# Altium schematic sheet LAN9254_C_P2.SchDoc
size 431 x 279 mm; DocumentNumber: 15; SheetNumber: 9; SheetTotal: 13
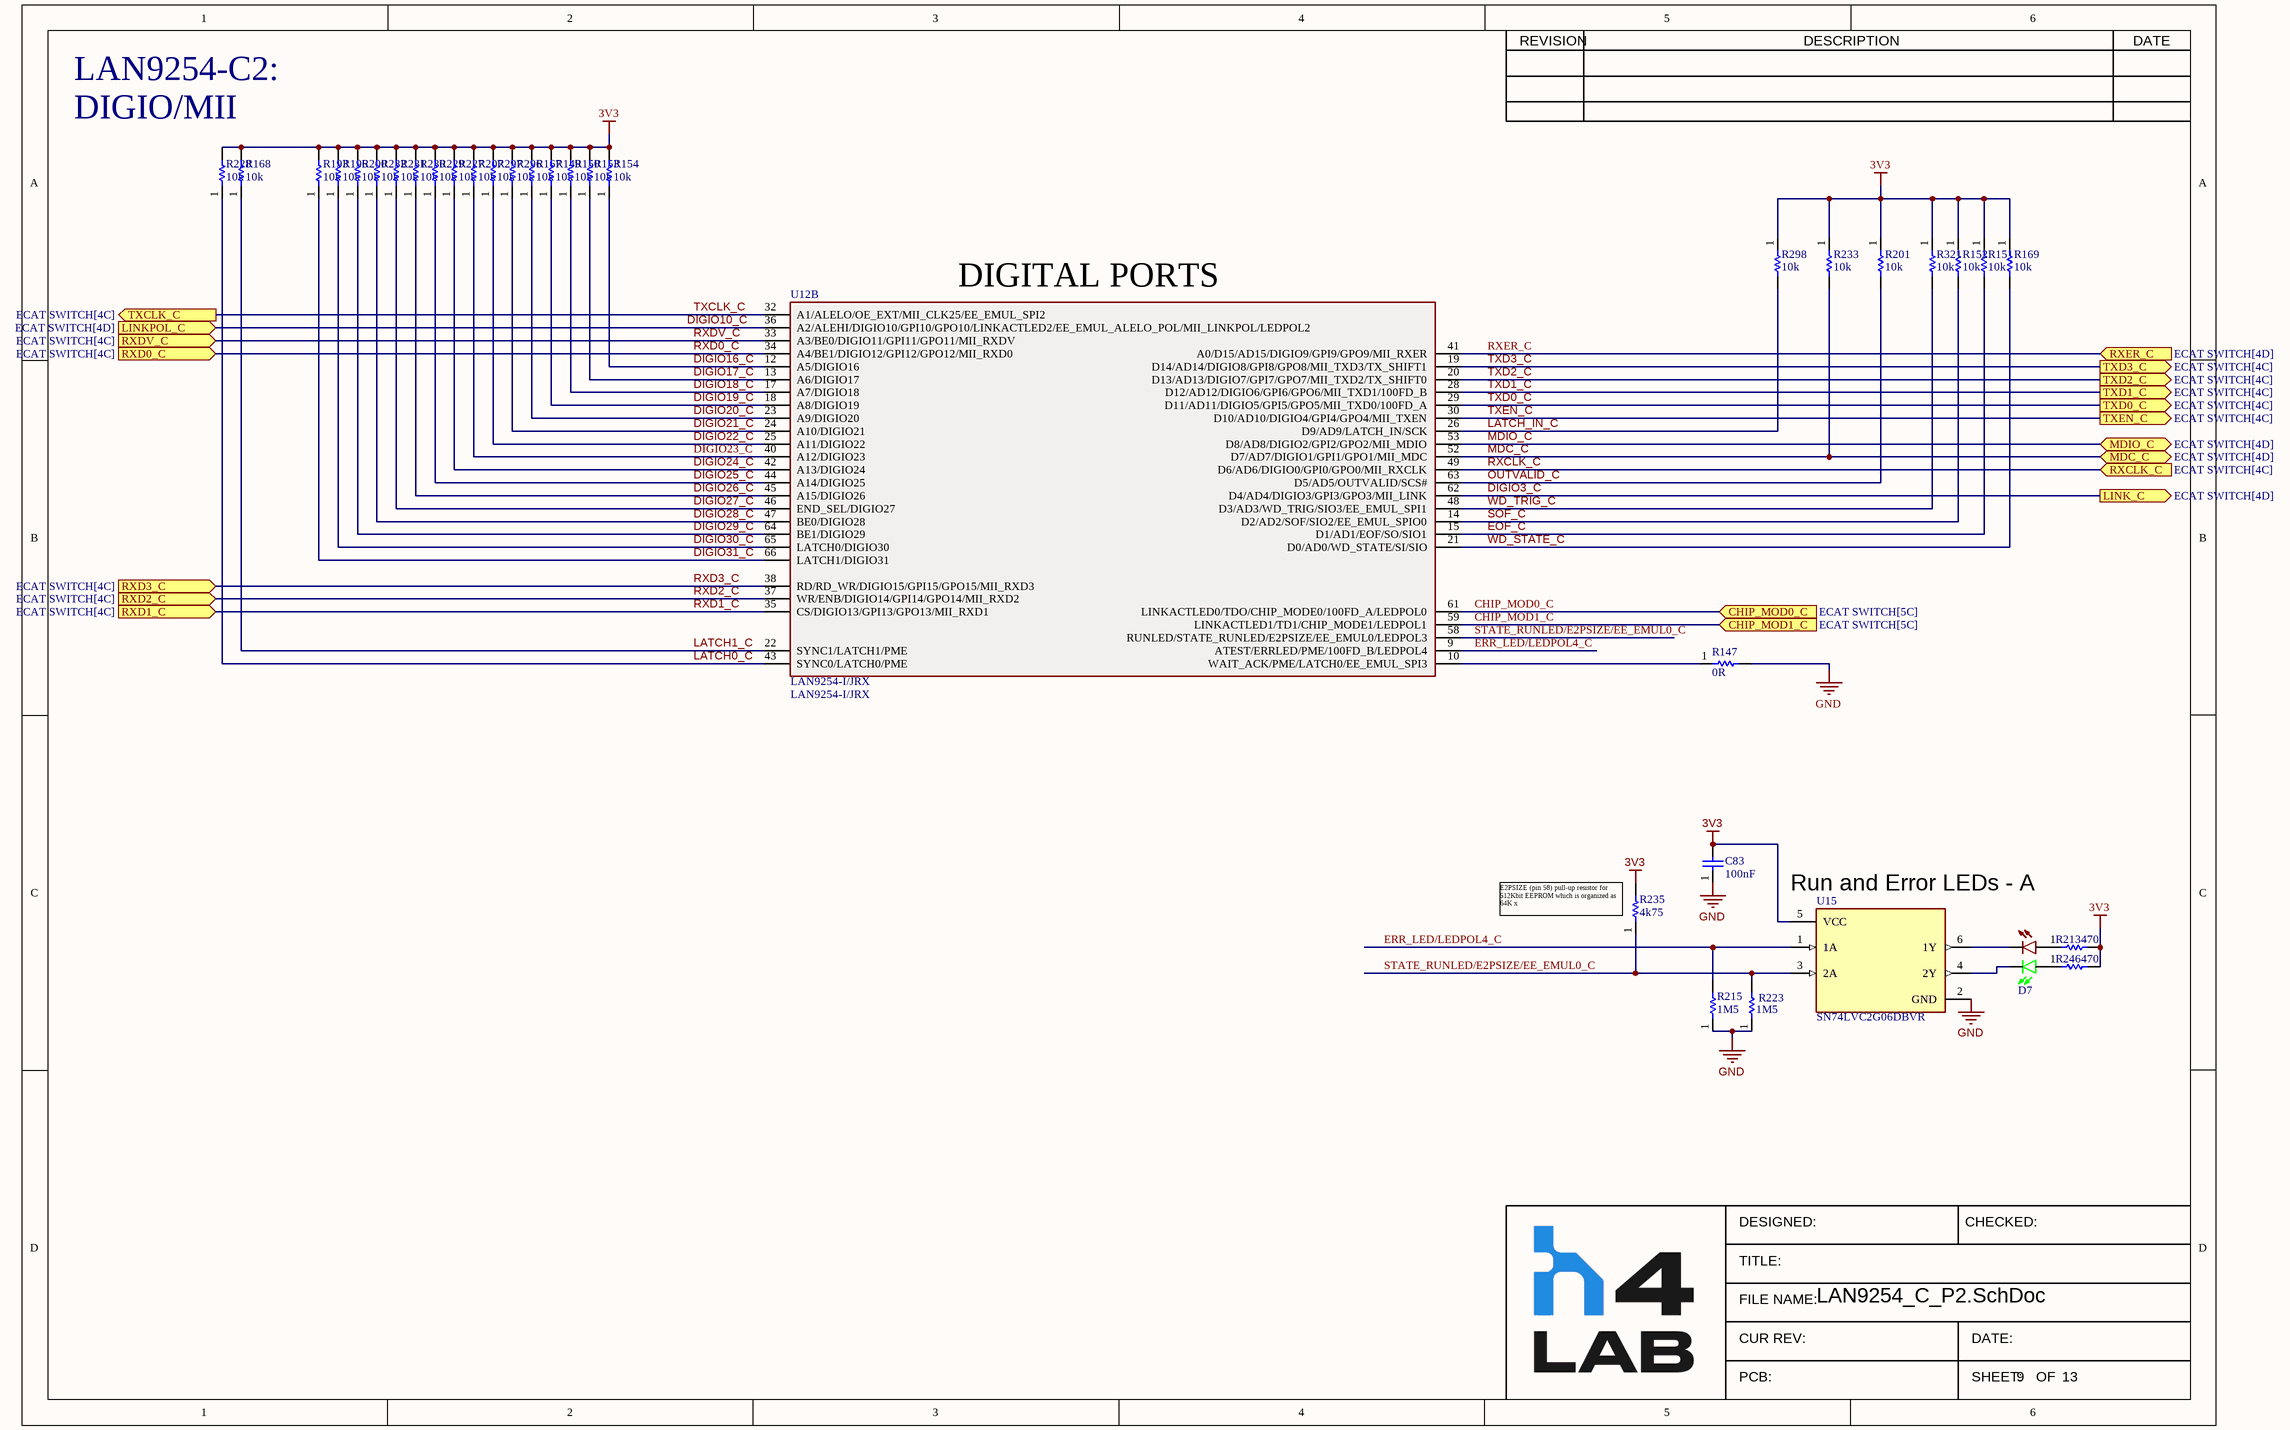
[diagram p0: LAN9254_C_P2.SchDoc]

## Parts
C83  value 100nF  [CAPC1005X03N(0402)]  (hidden comment: GRM155R71C104JA88D)
D7  LTST-C195KGJRKT  [Dual_LED]  (value not drawn)
R147  value 0R  [0402]  (hidden comment: RCS04020000Z0ED)
R149  value 10k  [RESC1005X06N(0402)]  (hidden comment: RC0402FR-0710KL)
R150  value 10k  [RESC1005X06N(0402)]  (hidden comment: RC0402FR-0710KL)
R151  value 10k  [RESC1005X06N(0402)]  (hidden comment: RC0402FR-0710KL)
R152  value 10k  [RESC1005X06N(0402)]  (hidden comment: RC0402FR-0710KL)
R153  value 10k  [RESC1005X06N(0402)]  (hidden comment: RC0402FR-0710KL)
R154  value 10k  [RESC1005X06N(0402)]  (hidden comment: RC0402FR-0710KL)
R167  value 10k  [RESC1005X06N(0402)]  (hidden comment: RC0402FR-0710KL)
R168  value 10k  [RESC1005X06N(0402)]  (hidden comment: RC0402FR-0710KL)
R169  value 10k  [RESC1005X06N(0402)]  (hidden comment: RC0402FR-0710KL)
R193  value 10k  [RESC1005X06N(0402)]  (hidden comment: RC0402FR-0710KL)
R196  value 10k  [RESC1005X06N(0402)]  (hidden comment: RC0402FR-0710KL)
R200  value 10k  [RESC1005X06N(0402)]  (hidden comment: RC0402FR-0710KL)
R201  value 10k  [RESC1005X06N(0402)]  (hidden comment: RC0402FR-0710KL)
R207  value 10k  [RESC1005X06N(0402)]  (hidden comment: RC0402FR-0710KL)
R213  value 470  [0402]  (hidden comment: CRCW0402470RJNED)
R215  value 1M5  [0402]  (hidden comment: CRCW04021M50JNED)
R223  value 1M5  [0402]  (hidden comment: CRCW04021M50JNED)
R227  value 10k  [RESC1005X06N(0402)]  (hidden comment: RC0402FR-0710KL)
R228  value 10k  [RESC1005X06N(0402)]  (hidden comment: RC0402FR-0710KL)
R229  value 10k  [RESC1005X06N(0402)]  (hidden comment: RC0402FR-0710KL)
R230  value 10k  [RESC1005X06N(0402)]  (hidden comment: RC0402FR-0710KL)
R231  value 10k  [RESC1005X06N(0402)]  (hidden comment: RC0402FR-0710KL)
R232  value 10k  [RESC1005X06N(0402)]  (hidden comment: RC0402FR-0710KL)
R233  value 10k  [RESC1005X06N(0402)]  (hidden comment: RC0402FR-0710KL)
R235  value 4k75  [RESC1005X06N(0402)]  (hidden comment: RC0402FR-074K75L)
R246  value 470  [0402]  (hidden comment: CRCW0402470RJNED)
R296  value 10k  [RESC1005X06N(0402)]  (hidden comment: RC0402FR-0710KL)
R297  value 10k  [RESC1005X06N(0402)]  (hidden comment: RC0402FR-0710KL)
R298  value 10k  [RESC1005X06N(0402)]  (hidden comment: RC0402FR-0710KL)
R321  value 10k  [RESC1005X06N(0402)]  (hidden comment: RC0402FR-0710KL)
U12  LAN9254-I/JRX  [QFP50P1400X1400X120-81N]  (part B of 2)
U15  SN74LVC2G06DBVR  [FP-DBV0006A-IPC_C]

## Ports
CHIP_MOD0_C (in, see ECAT SWITCH[5C]), CHIP_MOD1_C (in, see ECAT SWITCH[5C]), LINK_C (out, see ECAT SWITCH[4D]), LINKPOL_C (in, see ECAT SWITCH[4D]), MDC_C (bidir, see ECAT SWITCH[4D]), MDIO_C (bidir, see ECAT SWITCH[4D]), RXCLK_C (in, see ECAT SWITCH[4C]), RXD0_C (in, see ECAT SWITCH[4C]), RXD1_C (in, see ECAT SWITCH[4C]), RXD2_C (in, see ECAT SWITCH[4C]), RXD3_C (in, see ECAT SWITCH[4C]), RXDV_C (in, see ECAT SWITCH[4C]), RXER_C (in, see ECAT SWITCH[4D]), TXCLK_C (out, see ECAT SWITCH[4C]), TXD0_C (out, see ECAT SWITCH[4C]), TXD1_C (out, see ECAT SWITCH[4C]), TXD2_C (out, see ECAT SWITCH[4C]), TXD3_C (out, see ECAT SWITCH[4C]), TXEN_C (out, see ECAT SWITCH[4C])

## Nets
3V3: C83.2 R149.2 R150.2 R151.1 R152.1 R153.2 R154.2 R167.2 R168.2 R169.1 R193.2 R196.2 R200.2 R201.1 R207.2 R213.2 R227.2 R228.2 R229.2 R230.2 R231.2 R232.2 R233.1 R235.2 R246.2 R296.2 R297.2 R298.1 R321.1 U15.5(VCC)
GND: C83.1 R147.2 R215.1 R223.1 U15.2(GND)
CHIP_MOD0_C: U12.61(LINKACTLED0/TDO/CHIP_MODE0/100FD_A/LEDPOL0) ; port CHIP_MOD0_C
CHIP_MOD1_C: U12.59(LINKACTLED1/TD1/CHIP_MODE1/LEDPOL1) ; port CHIP_MOD1_C
DIGIO3_C: U12.62(D4/AD4/DIGIO3/GPI3/GPO3/MII_LINK) ; port LINK_C
DIGIO10_C: U12.36(A2/ALEHI/DIGIO10/GPI10/GPO10/LINKACTLED2/EE_EMUL_ALELO_POL/MII_LINKPOL/LEDPOL2) ; port LINKPOL_C
DIGIO16_C: R154.1 U12.12(A5/DIGIO16)
DIGIO17_C: R153.1 U12.13(A6/DIGIO17)
DIGIO18_C: R150.1 U12.17(A7/DIGIO18)
DIGIO19_C: R149.1 U12.18(A8/DIGIO19)
DIGIO20_C: R167.1 U12.23(A9/DIGIO20)
DIGIO21_C: R296.1 U12.24(A10/DIGIO21)
DIGIO22_C: R297.1 U12.25(A11/DIGIO22)
DIGIO23_C: R207.1 U12.40(A12/DIGIO23)
DIGIO24_C: R227.1 U12.42(A13/DIGIO24)
DIGIO25_C: R229.1 U12.44(A14/DIGIO25)
DIGIO26_C: R230.1 U12.45(A15/DIGIO26)
DIGIO27_C: R231.1 U12.46(END_SEL/DIGIO27)
DIGIO28_C: R232.1 U12.47(BE0/DIGIO28)
DIGIO29_C: R200.1 U12.64(BE1/DIGIO29)
DIGIO30_C: R196.1 U12.65(LATCH0/DIGIO30)
DIGIO31_C: R193.1 U12.66(LATCH1/DIGIO31)
EOF_C: R151.2 U12.15(D1/AD1/EOF/SO/SIO1)
ERR_LED/LEDPOL4_C: R215.2 U12.9(ATEST/ERRLED/PME/100FD_B/LEDPOL4) U15.1(1A)
LATCH0_C: R228.1 U12.43(SYNC0/LATCH0/PME)
LATCH1_C: R168.1 U12.22(SYNC1/LATCH1/PME)
LATCH_IN_C: R298.2 U12.26(D9/AD9/LATCH_IN/SCK)
MDC_C: R233.2 U12.52(D7/AD7/DIGIO1/GPI1/GPO1/MII_MDC) ; port MDC_C
MDIO_C: U12.53(D8/AD8/DIGIO2/GPI2/GPO2/MII_MDIO) ; port MDIO_C
OUTVALID_C: R201.2 U12.63(D5/AD5/OUTVALID/SCS#)
RXCLK_C: U12.49(D6/AD6/DIGIO0/GPI0/GPO0/MII_RXCLK) ; port RXCLK_C
RXD0_C: U12.34(A4/BE1/DIGIO12/GPI12/GPO12/MII_RXD0) ; port RXD0_C
RXD1_C: U12.35(CS/DIGIO13/GPI13/GPO13/MII_RXD1) ; port RXD1_C
RXD2_C: U12.37(WR/ENB/DIGIO14/GPI14/GPO14/MII_RXD2) ; port RXD2_C
RXD3_C: U12.38(RD/RD_WR/DIGIO15/GPI15/GPO15/MII_RXD3) ; port RXD3_C
RXDV_C: U12.33(A3/BE0/DIGIO11/GPI11/GPO11/MII_RXDV) ; port RXDV_C
RXER_C: U12.41(A0/D15/AD15/DIGIO9/GPI9/GPO9/MII_RXER) ; port RXER_C
SOF_C: R152.2 U12.14(D2/AD2/SOF/SIO2/EE_EMUL_SPIO0)
STATE_RUNLED/E2PSIZE/EE_EMUL0_C: R223.2 R235.1 U12.58(RUNLED/STATE_RUNLED/E2PSIZE/EE_EMUL0/LEDPOL3) U15.3(2A)
TXCLK_C: U12.32(A1/ALELO/OE_EXT/MII_CLK25/EE_EMUL_SPI2) ; port TXCLK_C
TXD0_C: U12.29(D11/AD11/DIGIO5/GPI5/GPO5/MII_TXD0/100FD_A) ; port TXD0_C
TXD1_C: U12.28(D12/AD12/DIGIO6/GPI6/GPO6/MII_TXD1/100FD_B) ; port TXD1_C
TXD2_C: U12.20(D13/AD13/DIGIO7/GPI7/GPO7/MII_TXD2/TX_SHIFT0) ; port TXD2_C
TXD3_C: U12.19(D14/AD14/DIGIO8/GPI8/GPO8/MII_TXD3/TX_SHIFT1) ; port TXD3_C
TXEN_C: U12.30(D10/AD10/DIGIO4/GPI4/GPO4/MII_TXEN) ; port TXEN_C
WD_STATE_C: R169.2 U12.21(D0/AD0/WD_STATE/SI/SIO)
WD_TRIG_C: R321.2 U12.48(D3/AD3/WD_TRIG/SIO3/EE_EMUL_SPI1)
NetD7_1: D7.1 R246.1
NetD7_2: D7.2 R213.1
NetD7_3: D7.3 U15.4(2Y)
NetD7_4: D7.4 U15.6(1Y)
NetR147_1: R147.1 U12.10(WAIT_ACK/PME/LATCH0/EE_EMUL_SPI3)

## Notes on the sheet
- LAN9254-C2:
- DIGIO/MII
- (near U12) DIGITAL PORTS
- (near R235) E2PSIZE (pin 58) pull-up resistor for 512Kbit EEPROM which is organized as 64K x
- (near U15) Run and Error LEDs - A
- REVISION
- DESCRIPTION
- DATE
- DESIGNED:
- CHECKED:
- TITLE:
- FILE NAME:
- CUR REV:
- PCB:
- SHEET:
- DATE:
- OF

## Library data of the parts
C83 = 100nF_16V_0402_CAP: CAP CER 0.1UF 16V X7R 0402; Tolerance: 5%; MPN: GRM155R71C104JA88D; Voltage Rating: 16V; Temp Coeff: X7R; Size/Package: 0402
D7 = Green/Red_LED: LED GREEN/RED CLEAR CHIP SMD; Color: Green, Red; Voltage Vf: 2V Green, 2V Red; Current If: 20mA. 20mA; MPN: LTST-C195KGJRKT; Mounting Type: SMD; Supplier 1: Digi-Key; Supplier Part Number 1: 160-1452-1-ND
R147 = 0R_1/5W_0402_RCS04020000Z0ED_RES: VISHAY - RCS04020000Z0ED - SMD Chip Resistor, 0402 [1005 Metric], 0 ohm, RCS Series, 50 V, Thick Film, 200 mW; Manufacturer: Vishay Dale; Resistance: 0mR; Max Power Dissipation: 200mW; Supplier 1: Digi-Key; Supplier Part Number 1: 541-2877-1-ND; Manufacturer Part Number: RCS04020000Z0ED; RoHS: Yes; Category: Chip SMD Resistors; Stock 1: 18214; Pricing 1: 1=0.10000, 10=0.08300, 25=0.05760, 50=0.04480, 100=0.03200, 250=0.02496, 500=0.01984, 1000=0.01408, 5000=0.01088 (USD); Case/Package: 0402; Case Code (Metric): 1005; Case Code (Imperial): 0402; Min Operating Temperature: -55°C; Max Operating Temperature: 155°C; Packaging: Tape and Reel; Resistor Type: Thick Film; Number of Terminations: 2; Features: Automotive AEC-Q200; Length: 0.039inch; Width: 0.02inch; Height: 0.016inch; RoHS Compliant: Yes; ComponentLink1URL: http://www.farnell.com/datasheets/2618474.pdf?src-supplier=Farnell; ComponentLink1Description: http://www.farnell.com/datasheets/2618474.pdf?src-supplier=Farnell; ComponentLink2URL: http://www.vishay.com/docs/20065/rcse3.pdf?src-supplier=Digi-Key; ComponentLink2Description: http://www.vishay.com/docs/20065/rcse3.pdf?src-supplier=Digi-Key; ComponentLink3URL: http://www.farnell.com/datasheets/2618474.pdf?src-supplier=Element14; ComponentLink3Description: http://www.farnell.com/datasheets/2618474.pdf?src-supplier=Element14; ComponentLink4URL: http://www.farnell.com/datasheets/2618474.pdf?src-supplier=Newark; ComponentLink4Description: http://www.farnell.com/datasheets/2618474.pdf?src-supplier=Newark
R149-R154 R167-R169 R193 R196 R200 R201 R207 R227-R233 R296-R298 R321 = 10k_1/16W_0402_RES: RES SMD 10K OHM 1% 1/16W 0402; MPN: RC0402FR-0710KL; Tolerance: 1%; Power: 1/16W; Size: 0402
R213 R246 = 470_1/10W_0402_CRCW0402470RJNED: Vishay CRCW Series Thick Film Resistor 0402 Case 470 5% 0.063W 200ppm/K; Manufacturer: Vishay Dale; Resistance: 470R; Max Power Dissipation: 63mW; Temperature Coefficient: 200ppm/°C; Voltage Rating: 50V; Supplier 1: Digi-Key; Manufacturer Part Number: CRCW0402470RJNED; RoHS: Yes; Category: Chip SMD Resistors; Pricing 1: 1=0,10000, 10=0,03300, 100=0,01360, 1000=0,00610, 2500=0,00529, 5000=0,00437 (USD); Case/Package: 0402; Number of Pins: 2; Weight: 2.3E-05oz; Case Code (Metric): 1005; Case Code (Imperial): 0402; Contact Plating: Tin; Min Operating Temperature: -55°C; Max Operating Temperature: 155°C; Packaging: Tape and Reel; Tolerance: 5%; Package Quantity: 1; Resistor Type: Thick Film; Number of Terminations: 2; Features: Automotive AEC-Q200; Power Rating: 63mW; Termination: SMD/SMT; Series: CRCW; Voltage Rating (DC): 50V; Resistance Tolerance: 5%; Construction: Rectangular; Technology: THICK FILM; Length: 1mm; Width: 0.02inch; Height: 0.35mm; Depth: 0.5mm; Radiation Hardening: No; RoHS Compliant: Yes; Lead Free: Lead Free; Military Standard: Not; REACH SVHC: Unknown; ComponentLink1URL: https://datasheet.ciiva.com/2461/dcrcwe3-2461992.pdf?src-supplier=Digi-Key; ComponentLink1Description: https://datasheet.ciiva.com/2461/dcrcwe3-2461992.pdf?src-supplier=Digi-Key; ComponentLink2URL: https://datasheet.ciiva.com/2461/dcrcwe3-2461993.pdf?src-supplier=Digi-Key; ComponentLink2Description: https://datasheet.ciiva.com/2461/dcrcwe3-2461993.pdf?src-supplier=Digi-Key; ComponentLink3URL: https://datasheet.ciiva.com/2461/dcrcwe3-2461994.pdf?src-supplier=Digi-Key; ComponentLink3Description: https://datasheet.ciiva.com/2461/dcrcwe3-2461994.pdf?src-supplier=Digi-Key; ComponentLink4URL: https://datasheet.ciiva.com/5550/dcrcwe3-109170-5550440.pdf?src-supplier=Mouser; ComponentLink4Description: https://datasheet.ciiva.com/5550/dcrcwe3-109170-5550440.pdf?src-supplier=Mouser; ComponentLink5URL: https://datasheet.ciiva.com/3256/dcrcwe3-3256554.pdf?src-supplier=Avnet; ComponentLink5Description: https://datasheet.ciiva.com/3256/dcrcwe3-3256554.pdf?src-supplier=Avnet; ComponentLink6URL: https://datasheet.ciiva.com/8336/dcrcwe3-8336717.pdf?src-supplier=Avnet; ComponentLink6Description: https://datasheet.ciiva.com/8336/dcrcwe3-8336717.pdf?src-supplier=Avnet; ComponentLink7URL: https://datasheet.ciiva.com/28571/1847332-28571880.pdf?src-supplier=Element14; ComponentLink7Description: https://datasheet.ciiva.com/28571/1847332-28571880.pdf?src-supplier=Element14; Supplier Part Number 1: 541-470JDKR-ND
R215 R223 = 1M5_1/16W_0402_CRCW04021M50JNED_RES: RES SMD 1.5M OHM 5% 1/16W 0402; Manufacturer: Vishay Dale; Resistance: 1.5MR; Power Rating: 63mW; Voltage Rating: 50V; Temperature Coefficient: 200ppm/°C; Supplier 1: Digi-Key; Manufacturer Part Number: CRCW04021M50JNED; RoHS: Yes; Category: Chip SMD Resistors; Stock 1: 7870; Pricing 1: 1=0,10000, 10=0,03300, 100=0,01360, 1000=0,00610, 2500=0,00529, 5000=0,00437 (USD); Case/Package: 0402; Weight: 2.3E-05oz; Case Code (Imperial): 0402; Case Code (Metric): 1005; Contact Plating: Tin; Min Operating Temperature: -55°C; Max Operating Temperature: 155°C; Tolerance: 5%; Package Quantity: 1; Packaging: Tape and Reel; Termination: SMD/SMT; Resistor Type: Thick Film; Number of Terminations: 2; Max Power Dissipation: 63mW; Voltage Rating (DC): 50V; Features: Automotive AEC-Q200; Series: CRCW; Construction: Rectangular; Length: 1mm; Width: 0.5mm; Height: 0.016inch; Depth: 0.5mm; Radiation Hardening: No; RoHS Compliant: Yes; Military Standard: Not; Lead Free: Lead Free; ComponentLink1URL: https://datasheet.ciiva.com/9100/dcrcwe3-9100251.pdf?src-supplier=Avnet; ComponentLink1Description: https://datasheet.ciiva.com/9100/dcrcwe3-9100251.pdf?src-supplier=Avnet; ComponentLink2URL: https://datasheet.ciiva.com/2493/dcrcwe3-2493529.pdf?src-supplier=Digi-Key; ComponentLink2Description: https://datasheet.ciiva.com/2493/dcrcwe3-2493529.pdf?src-supplier=Digi-Key; ComponentLink3URL: https://datasheet.ciiva.com/2493/dcrcwe3-2493530.pdf?src-supplier=Digi-Key; ComponentLink3Description: https://datasheet.ciiva.com/2493/dcrcwe3-2493530.pdf?src-supplier=Digi-Key; ComponentLink4URL: https://datasheet.ciiva.com/2493/dcrcwe3-2493531.pdf?src-supplier=Digi-Key; ComponentLink4Description: https://datasheet.ciiva.com/2493/dcrcwe3-2493531.pdf?src-supplier=Digi-Key; Supplier Part Number 1: 541-1.5MJCT-ND
R235 = 4k75_1/16_0402_RES: RES SMD 4.75K OHM 1% 1/16W 0402; Power: 1/16; MPN: RC0402FR-074K75L; Tolerance: 1%; Package/Case: 0402
U12 = LAN9254-I/JRX: 2/3-PORT Ethercat Slave Controller With 32 Digios With Integrated Ethernet Phys; Manufacturer: Microchip; Supplier 1: Digi-Key; Manufacturer Part Number: LAN9254-I/JRX; RoHS: Yes; Pricing 1: 1=14.24000, 25=12.99000 (USD); RoHS Compliant: Yes; Supplier Part Number 1: 150-LAN9254-I/JRX-ND
U15 = BUF_dual_SN74LVC2G06DBVR: Buffer/Driver 2-CH Inverting Open Drain CMOS 6-Pin SOT-23 T/R; Manufacturer: Texas Instruments; Number of Channels: 2; Propagation Delay: 2.9ns; Min Supply Voltage: 1.65V; High Level Output Current: 32mA; Logic Function: Buffer; Max Supply Voltage: 5.5V; Nominal Supply Current: 40mA; Turn-On Delay Time: 7.2ns; Quiescent Current: 10uA; Number of Inputs: 1; Height: 1.15mm; Radiation Hardening: No; Length: 2.9mm; Number of Output Lines: 2; Package Quantity: 3000; Min Operating Temperature: -40°C; Case/Package: SOT-23; REACH SVHC: No SVHC; Number of Elements: 2; Number of Pins: 6; Mount: Surface Mount; Polarity: Inverting; Contact Plating: Gold; Number of Input Lines: 2; Number of Outputs: 2; Number of Circuits: 2; Number of Gates: 2; Max Operating Temperature: 125°C; RoHS Compliant: Yes; Low Level Output Current: 32mA; Number of Bits: 2; Width: 1.6mm; Packaging: Tape and Reel; Lead Free: Lead Free; Supplier 1: Digi-Key; Manufacturer Part Number: SN74LVC2G06DBVR; RoHS: Yes; Category: Logic Gates; Stock 1: 3468; Pricing 1: 1=0,47000, 10=0,35600, 25=0,32080, 100=0,22150, 250=0,18656, 500=0,15158, 1000=0,11660 (USD); ComponentLink1URL: https://datasheet.ciiva.com/22719/1737061-22719510.pdf?src-supplier=Element14; ComponentLink1Description: https://datasheet.ciiva.com/22719/1737061-22719510.pdf?src-supplier=Element14; ComponentLink2URL: https://datasheet.ciiva.com/7293/sn74lvc2g06-7293674.pdf?src-supplier=Newark; ComponentLink2Description: https://datasheet.ciiva.com/7293/sn74lvc2g06-7293674.pdf?src-supplier=Newark; ComponentLink3URL: https://datasheet.ciiva.com/46439/1786796-46439655.pdf?src-supplier=Element14; ComponentLink3Description: https://datasheet.ciiva.com/46439/1786796-46439655.pdf?src-supplier=Element14; ComponentLink4URL: https://datasheet.ciiva.com/1864/sn74lvc2g06-1864312.pdf?src-supplier=Digi-Key; ComponentLink4Description: https://datasheet.ciiva.com/1864/sn74lvc2g06-1864312.pdf?src-supplier=Digi-Key; ComponentLink5URL: https://datasheet.ciiva.com/1864/sn74lvc2g06-1864311.pdf?src-supplier=Digi-Key; ComponentLink5Description: https://datasheet.ciiva.com/1864/sn74lvc2g06-1864311.pdf?src-supplier=Digi-Key; ComponentLink6URL: https://datasheet.ciiva.com/1864/sn74lvc2g06-1864313.pdf?src-supplier=Digi-Key; ComponentLink6Description: https://datasheet.ciiva.com/1864/sn74lvc2g06-1864313.pdf?src-supplier=Digi-Key; ComponentLink7URL: https://datasheet.ciiva.com/14301/sn74lvc2g06-14301182.pdf?src-supplier=Avnet; ComponentLink7Description: https://datasheet.ciiva.com/14301/sn74lvc2g06-14301182.pdf?src-supplier=Avnet; ComponentLink8URL: https://datasheet.ciiva.com/26220/sn74lvc2g06-26220937.pdf?src-supplier=Avnet+Europe; ComponentLink8Description: https://datasheet.ciiva.com/26220/sn74lvc2g06-26220937.pdf?src-supplier=Avnet+Europe; Supplier Part Number 1: 296-13492-1-ND